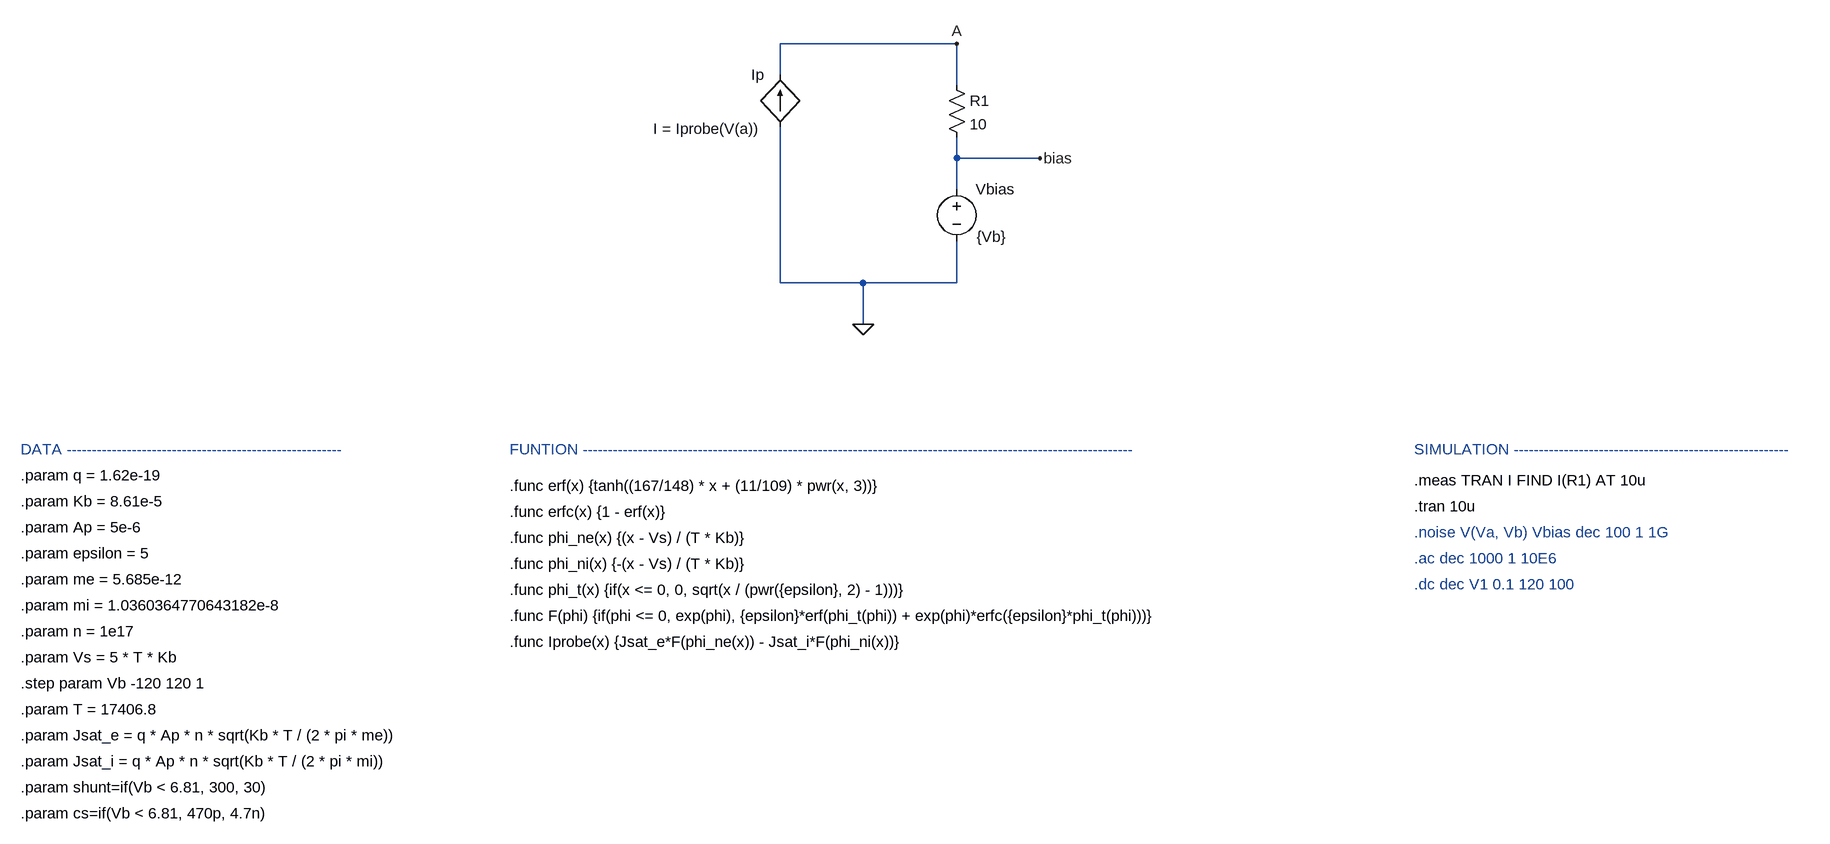
[diagram p0: schematic 2-probe_model.asc]
2-probe_model.asc, the LTspice schematic file:
Version 4.1
SHEET 1 3696 1140
WIRE 2144 -1904 1872 -1904
WIRE 1872 -1856 1872 -1904
WIRE 2144 -1840 2144 -1904
WIRE 2144 -1728 2144 -1760
WIRE 2272 -1728 2144 -1728
WIRE 2144 -1680 2144 -1728
WIRE 1872 -1536 1872 -1776
WIRE 2000 -1536 1872 -1536
WIRE 2144 -1536 2144 -1600
WIRE 2144 -1536 2000 -1536
WIRE 2000 -1472 2000 -1536
FLAG 2000 -1472 0
FLAG 2272 -1728 bias
FLAG 2144 -1904 A
SYMBOL bi 1872 -1776 R180
WINDOW 0 24 80 Left 2
WINDOW 3 29 -3 Left 2
SYMATTR InstName Ip
SYMATTR Value I = Iprobe(V(a))
SYMBOL voltage 2144 -1696 R0
WINDOW 123 0 0 Left 0
WINDOW 39 0 0 Left 0
WINDOW 0 29 16 Left 2
WINDOW 3 31 89 Left 2
SYMATTR InstName Vbias
SYMATTR Value {Vb}
SYMBOL res 2128 -1856 R0
SYMATTR InstName R1
SYMATTR Value 10
TEXT 2848 -1112 Left 2 ;.ac dec 1000 1 10E6
TEXT 2848 -1072 Left 2 ;.dc dec V1 0.1 120 100
TEXT 704 -720 Left 2 !.param cs=if(Vb < 6.81, 470p, 4.7n)
TEXT 2848 -1152 Left 2 ;.noise V(Va, Vb) Vbias dec 100 1 1G
TEXT 704 -760 Left 2 !.param shunt=if(Vb < 6.81, 300, 30)
TEXT 2848 -1192 Left 2 !.tran 10u
TEXT 2848 -1232 Left 2 !.meas TRAN I FIND I(R1) AT 10u
TEXT 1456 -1024 Left 2 !.func F(phi) {if(phi <= 0, exp(phi), {epsilon}*erf(phi_t(phi)) + exp(phi)*erfc({epsilon}*phi_t(phi)))}
TEXT 1456 -1224 Left 2 !.func erf(x) {tanh((167/148) * x + (11/109) * pwr(x, 3))}
TEXT 1456 -1280 Left 2 ;FUNTION --------------------------------------------------------------------------------------------------------------
TEXT 2848 -1280 Left 2 ;SIMULATION -------------------------------------------------------
TEXT 1456 -1184 Left 2 !.func erfc(x) {1 - erf(x)}
TEXT 1456 -1064 Left 2 !.func phi_t(x) {if(x <= 0, 0, sqrt(x / (pwr({epsilon}, 2) - 1)))}
TEXT 704 -880 Left 2 !.param T = 17406.8
TEXT 704 -960 Left 2 !.param Vs = 5 * T * Kb
TEXT 704 -1160 Left 2 !.param Ap = 5e-6
TEXT 704 -1120 Left 2 !.param epsilon = 5
TEXT 704 -1080 Left 2 !.param me = 5.685e-12
TEXT 704 -1040 Left 2 !.param mi = 1.0360364770643182e-8
TEXT 704 -1000 Left 2 !.param n = 1e17
TEXT 704 -840 Left 2 !.param Jsat_e = q * Ap * n * sqrt(Kb * T / (2 * pi * me))
TEXT 704 -800 Left 2 !.param Jsat_i = q * Ap * n * sqrt(Kb * T / (2 * pi * mi))
TEXT 704 -1280 Left 2 ;DATA -------------------------------------------------------
TEXT 1456 -1144 Left 2 !.func phi_ne(x) {(x - Vs) / (T * Kb)}
TEXT 704 -920 Left 2 !.step param Vb -120 120 1
TEXT 704 -1240 Left 2 !.param q = 1.62e-19
TEXT 1456 -1104 Left 2 !.func phi_ni(x) {-(x - Vs) / (T * Kb)}
TEXT 704 -1200 Left 2 !.param Kb = 8.61e-5
TEXT 1456 -984 Left 2 !.func Iprobe(x) {Jsat_e*F(phi_ne(x)) - Jsat_i*F(phi_ni(x))}

The netlist it stands for:
* 2-probe_model.asc
B§Ip 0 A I = Iprobe(V(a))
Vbias bias 0 {Vb}
R1 A bias 10
* .ac dec 1000 1 10E6
* .dc dec V1 0.1 120 100
.param cs=if(Vb < 6.81, 470p, 4.7n)
* .noise V(Va, Vb) Vbias dec 100 1 1G
.param shunt=if(Vb < 6.81, 300, 30)
.tran 10u
.meas TRAN I FIND I(R1) AT 10u
.func F(phi) {if(phi <= 0, exp(phi), {epsilon}*erf(phi_t(phi)) + exp(phi)*erfc({epsilon}*phi_t(phi)))}
.func erf(x) {tanh((167/148) * x + (11/109) * pwr(x, 3))}
* FUNTION --------------------------------------------------------------------------------------------------------------
* SIMULATION -------------------------------------------------------
.func erfc(x) {1 - erf(x)}
.func phi_t(x) {if(x <= 0, 0, sqrt(x / (pwr({epsilon}, 2) - 1)))}
.param T = 17406.8
.param Vs = 5 * T * Kb
.param Ap = 5e-6
.param epsilon = 5
.param me = 5.685e-12
.param mi = 1.0360364770643182e-8
.param n = 1e17
.param Jsat_e = q * Ap * n * sqrt(Kb * T / (2 * pi * me))
.param Jsat_i = q * Ap * n * sqrt(Kb * T / (2 * pi * mi))
* DATA -------------------------------------------------------
.func phi_ne(x) {(x - Vs) / (T * Kb)}
.step param Vb -120 120 1
.param q = 1.62e-19
.func phi_ni(x) {-(x - Vs) / (T * Kb)}
.param Kb = 8.61e-5
.func Iprobe(x) {Jsat_e*F(phi_ne(x)) - Jsat_i*F(phi_ni(x))}
.backanno
.end